# Altium schematic sheet Sche.SchDoc
size A
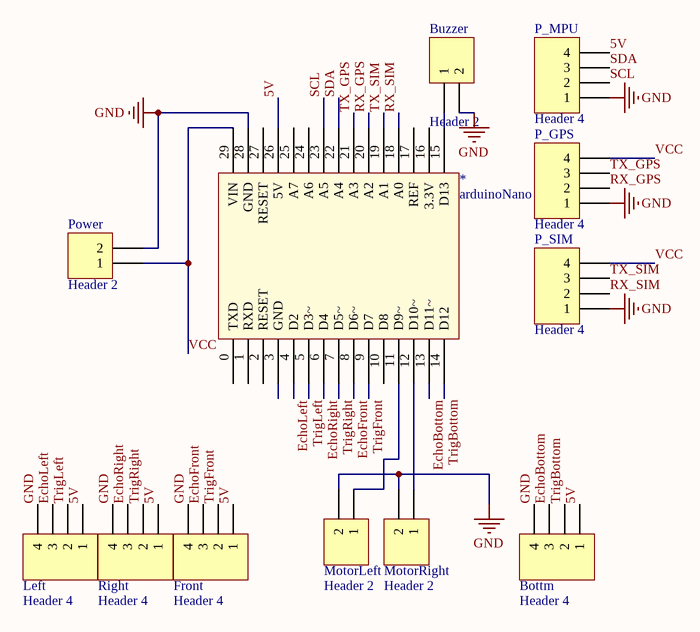
[diagram p0: Sche.SchDoc]

## Parts
*  arduinoNano  [Arduino nano]
Bottm  Header 4  [HDR1X4]
Buzzer  Header 2  [HDR1X2]
Front  Header 4  [HDR1X4]
Left  Header 4  [HDR1X4]
MotorLeft  Header 2  [HDR1X2]
MotorRight  Header 2  [HDR1X2]
P_GPS  Header 4  [HDR1X4]
P_MPU  Header 4  [HDR1X4]
P_SIM  Header 4  [HDR1X4]
Power  Header 2  [HDR1X2]
Right  Header 4  [HDR1X4]

## Nets
GND: *.28(GND) Bottm.4 Buzzer.2 Front.4 Left.4 MotorLeft.2 MotorRight.2 P_GPS.1 P_MPU.1 P_SIM.1 Power.2 Right.4
5V: *.26(5V) Bottm.1 Front.1 Left.1 P_MPU.4 Right.1
EchoBottom: *.13(D11~) Bottm.3
EchoFront: *.8(D6~) Front.3
EchoLeft: *.4(D2) Left.3
EchoRight: *.6(D4) Right.3
RX_GPS: *.20(A2) P_GPS.2
RX_SIM: *.18(A0) P_SIM.2
SCL: *.23(A5) P_MPU.2
SDA: *.22(A4) P_MPU.3
TrigBottom: *.14(D12) Bottm.2
TrigFront: *.9(D7) Front.2
TrigLeft: *.5(D3~) Left.2
TrigRight: *.7(D5~) Right.2
TX_GPS: *.21(A3) P_GPS.3
TX_SIM: *.19(A1) P_SIM.3
VCC: *.29(VIN) P_GPS.4 P_SIM.4 Power.1
Net*_11: *.11(D9~) MotorLeft.1
Net*_12: *.12(D10~) MotorRight.1
Net*_15: *.15(D13) Buzzer.1

Not connected (* = marked no-connect by the designer): * 0(TXD) 1(RXD) 2(RESET) 3(GND) 10(D8) 16(3.3V) 17(REF) 24(A6) 25(A7) 27(RESET)

## Library data of the parts
Bottm Front Left P_GPS P_MPU P_SIM Right = Header 4: Header, 4-Pin; LatestRevisionDate: 17-Jul-2002; LatestRevisionNote: Re-released for DXP Platform.; Publisher: Altium Limited
Buzzer MotorLeft MotorRight Power = Header 2: Header, 2-Pin; LatestRevisionDate: 17-Jul-2002; LatestRevisionNote: Re-released for DXP Platform.; Publisher: Altium Limited